# EAGLE design Adafruit_ADXL345 (EAGLE 6.3)
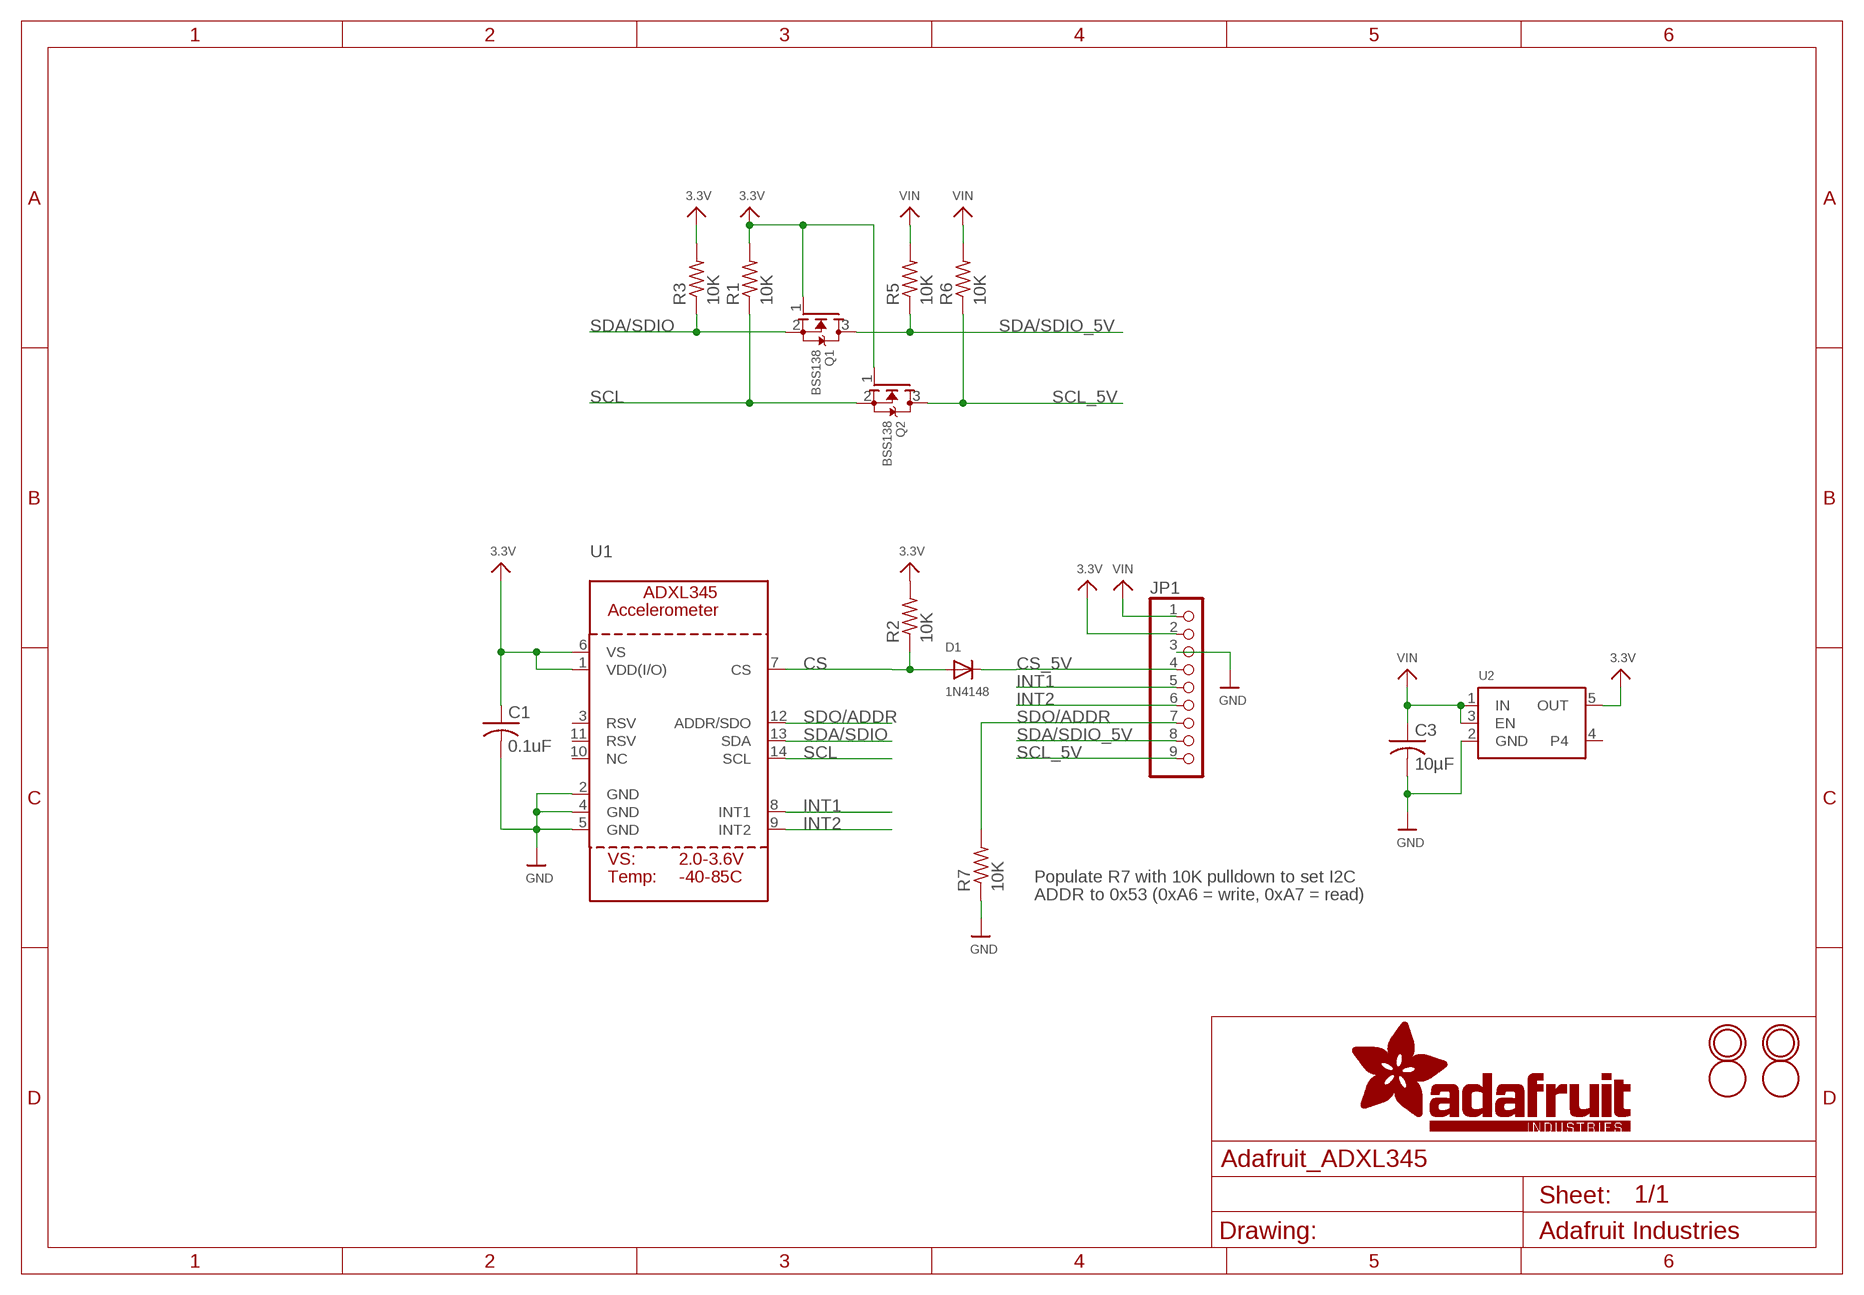
[diagram p0: schematic, sheet 1]

## Parts
C1  0.1uF  C-USC0805  [C0805]
C3  10µF  C-USC0805  [C0805]
D1  1N4148  DIODESOD-323  [SOD-323]
JP1  HEADER-1X970MIL  [1X09_ROUND_70]
Q1  BSS138  MOSFET-NWIDE  [SOT23-WIDE]
Q2  BSS138  MOSFET-NWIDE  [SOT23-WIDE]
R1  10K  R-US_R0805  [R0805]
R2  10K  R-US_R0805  [R0805]
R3  10K  R-US_R0805  [R0805]
R5  10K  R-US_R0805  [R0805]
R6  10K  R-US_R0805  [R0805]
R7  10K  R-US_R0805  [R0805]
U1  ACCEL_ADXL345  [LGA14]
U2  VREG_SOT23-5  [SOT23-5]
U$1  FIDUCIAL  [FIDUCIAL_1MM]
U$3  FIDUCIAL  [FIDUCIAL_1MM]
U$4  MOUNTINGHOLE2.5  [MOUNTINGHOLE_2.5_PLATED]
U$6  MOUNTINGHOLE2.5  [MOUNTINGHOLE_2.5_PLATED]

## Nets
3.3V: C1.1 JP1.2 Q1.1(G) Q2.1(G) R1.2 R2.2 R3.2 U1.1(VDD(I/O)) U1.6(VS) U2.5(OUT)
CS: D1.A R2.1 U1.7(CS)
CS_5V: D1.C JP1.4
GND: C1.2 C3.2 JP1.3 R7.1 U1.2(GND) U1.4(GND) U1.5(GND) U2.2(GND)
INT1: JP1.5 U1.8(INT1)
INT2: JP1.6 U1.9(INT2)
SCL: Q2.2(S) R1.1 U1.14(SCL)
SCL_5V: JP1.9 Q2.3(D) R6.1
SDA/SDIO: Q1.2(S) R3.1 U1.13(SDA)
SDA/SDIO_5V: JP1.8 Q1.3(D) R5.1
SDO/ADDR: JP1.7 R7.2 U1.12(ADDR/SDO)
VIN: C3.1 JP1.1 R5.2 R6.2 U2.1(IN) U2.3(EN)
Unconnected: U1.3(RSV) U1.10(NC) U1.11(RSV) U2.4

## Notes on the sheet
- Populate R7 with 10K pulldown to set I2C
- ADDR to 0x53 (0xA6 = write, 0xA7 = read)

## Library data of the parts
C1 C3 = adafruit:C-US: CAPACITOR, American symbol
D1 = microbuilder:DIODE: Diode SMA Model Volts Amps Type Vf Vr Digikey # Notes SSA34-E3 40V 3A Schottky 480mV @ 3A 200uA @ 40V SSA34-E3/61TGITR-ND CDBA120-G 20V 1A Schottky 500mV @ 1A 500uA @ 20V 641-1014-6-ND REEL MBRA210 10V 2A Schottky 350mV @ 2A 700uA @ 10V MBRA210LT3 SOD-123 Model Volts Amps Type Vf Vr Order # Notes BAT54T1G 30V 200mA Schottky 800mV @ 200mA 2uA @ 25V BAT54T1GOSTR-ND B0530W 30V 500mA Schottky 430mV @ 500mA 130uA @ 30V B0530W-FDICT-ND REEL MBR120 20V 1A Schottky 340mV @ 1A MBR120VLSFT1GOSCT-ND SOD-323 Model Volts Amps Type Vf Vr Order # Notes PMEG2005EJ 20V 500mA Schottky 355mV @ 500mA 568-4110-1-ND ZLLS410 10V 570mA Schottky 380mV @ 570mA ZLLS410CT-ND 1N4148WS 75V 150mA Silicon/Simple 1V 1N4148WSFSCT-ND REEL SOD-523 Model Volts Amps Type Vf Vr Order # Notes BAT54XV2 30V 200mA Schottky 0.8V @ 100mA BAT54XV2CT-ND TB751S 30V 30mA Schottky RB751S-40TE61CT-ND SOT23-R/W (R = Solder Paste/Reflow Ovens, W = Hand-Soldering) Model Volts Amps Type Vf Vr Order # Notes BAT54FILM 40V 300mA Schottky 497-7162-1-ND
JP1 = microbuilder:HEADER-1X9: PIN HEADER
Q1 Q2 = microbuilder:MOSFET-N: N-Channel Mosfet LEGEND VDS: Voltage Drain-Source ID: Drain Current RDS(ON): Drain-Source On-State Resistance VGS(TH): Gate-Source Threshold Voltage CISS: Drain-Source Input Capacitance SOT-23 Name VDS ID RDS(ON) VGS(TH) CISS Order Number 2N7002E 60V 260mA 2.5 Ohm 2.5V @ 250uA 26.7pF @ 25V 2N7002ET1GOSTR-ND BSH103 30V 850mA 400 mOhm 400mV @ 1mA 83pF @ 24V BSH103,235-ND BSS138 60V 320mA 1.6 Ohm 1.5V @ 250uA 50pF @ 10V Mouser: 771-BSS138PW115 DMN2075U-7 20V 4.2A 38 mOhm 1V @ 250 uA 594.3pF @ 10V DMN2075U-7DICT-ND * BSS138 good choice for I2C level-shifting
R1-R3 R5-R7 = adafruit:R-US_: RESISTOR, American symbol
U1 = microbuilder:ACCEL_ADXL345: ADXL345 - Digital 3-Axis Accelerometer (I2C/SPI)
U2 = microbuilder:VREG_SOT23-5: SOT23-5 Fixed Voltage Regulators Part Current Out V Out V In V Dropout θJA (°C/W) TJ (°C) Digikey Part No. ADP121 150mA 3.3V 3.4-5.5V 0.09V @ 150mA -- -- ADP121-AUJZ33R7CT-ND ADP121 150mA 3.0V 3.1-5.5V 0.09V @ 150mA -- -- ADP121-AUJZ30R7CT-ND ADP122 300mA 3.3V 3.4-5.5V 0.085V @ 300mA -- -- ADP122AUJZ-3.3-R7CT-ND ADP1712 300mA 3.3V 3.5-5.5V 0.17V @ 300mA -- -- ADP1712AUJZ-3.3-R7TR-ND AP7311 (Low Cost) 150mA 3.3V 3.5-6V 0.15V @ 150mA -- -- AP7311-33WG-7DICT-ND LD39015M18R 150mA 1.8V 1.9V-5.5V 0.08V @ 100mA -- -- 497-6977-1-ND LP2985A-33DBVR 150mA 3.3V 3.3-16V 0.28V @ 150mA 206 150 296-18479-1-ND MCP1824T-3302E/OT 300mA 3.3V 3.5V-6V 0.2V @ 300mA -- -- MCP1824T-3302E/OTCT-ND MIC5205-2.5YM5 TR 150mA 2.5V 2.7-16V 0.165V @ 150mA -- -- 576-1257-2-ND MIC5205-3.0YM5 TR 150mA 3.0V 3.2V-16V 0.165V @ 150mA -- -- 576-1258-2-ND MIC5205-3.3YM5 TR 150mA 3.3V 3.5V-16V 0.165V @ 150mA -- -- 576-1259-2-ND TPS780330220 150mA 3.3V+2.2V 3.6-5.5V 250mV Max -- -- 296-23332-1-ND TDA3663/N1,135 100mA 3.3V 3.5-45V 0.18V @ 50mA -- -- 568-5343-1-ND Max operating temp can be calculated using θJA, TJ (max junction temperature), and power in watts. Set the "Maximum Ambient Temperature" until it reaches TJ ("Max Junction Temperature"), which is the absolute limit for safe use of the regulator: Heat Sink Temperature Calculator <http://www.daycounter.com/Calculators/Heat-Sink-Temperature-Calculator.phtml> For example, With 12V source into a 3.3V LP2985 and a 30mA load, we are dissipating (12V-3.3V) * 0.03A = 0.261W. With a θJA of 206 °C/W, a TJ of 150°C, and 261mW we can safely use the chip without a heat sink up to 75°C (=147.1°C Junction Temperature).
U$1 U$3 = adafruit:FIDUCIAL: For use by pick and place machines to calibrate the vision/machine, 1mm By microbuilder.eu
U$4 U$6 = microbuilder:MOUNTINGHOLE: Mounting Hole For #2 screws (0.086"/2.18mm width, 0.094"/2.4mm hole) use 2.5mm

## Board
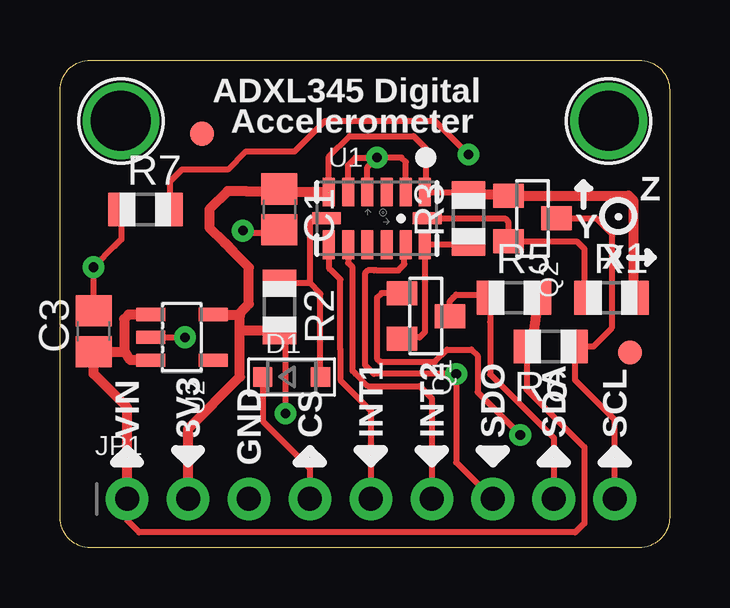
[diagram p1: board, top side]
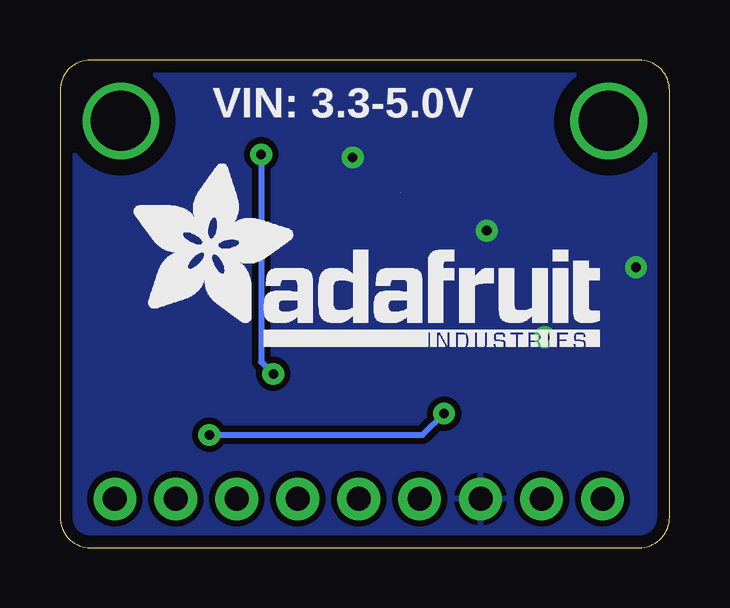
[diagram p2: board, bottom side, seen from below]

Size 25.4 x 20.32 mm. Coordinates in mm from the lower left corner, seen from the top.
Outline: 1.27,0 arc-90 0,1.27 0,19.05 arc-90 1.27,20.32 24.13,20.32 arc-90 25.4,19.05 25.4,1.27 arc-90 24.13,0 1.27,0
Copper layers (1*16): Top 0.035mm / dielectric 1.5mm / Bottom 0.035mm
Design rules "default": minimum track width 8mil, minimum drill 0.4mm, track to track 8mil, track to pad 8mil, pad to pad 8mil, via to via 8mil, smd to smd 8mil, copper to edge 20mil, drill to drill 8mil, minimum pad ring 8mil, minimum via ring 10mil, stop-mask expansion 3mil, vias tented up to drill 20mil, thermal gap 8mil

### Footprints (pad centres in the part's own frame; a part is rotated, then mirrored left to right if it is on the bottom)
C0805 = smd 1.3 x 1.5: 1 -0.85,0; 2 0.85,0
SOD-323 = smd 0.8 x 0.8: A 1.2,0; C -1.2,0
1X09_ROUND_70 = drill 1 pad 1.778: 1 -10.16,0; 2 -7.62,0; 3 -5.08,0; 4 -2.54,0; 5 0,0; 6 2.54,0; 7 5.08,0; 8 7.62,0; 9 10.16,0
SOT23-WIDE = smd 1 x 1.27: 1 -0.95,-1; 2 0.95,-1; 3 0,1
R0805 = smd 1.1 x 1.4: 1 -1,0; 2 1,0
LGA14 = smd 0.5 x 1.2: 1 2,1.1; 2 1.2,1.1; 3 0.4,1.1; 4 -0.4,1.1; 5 -1.2,1.1; 6 -2,1.1; 8 -2,-1.1; 9 -1.2,-1.1; 10 -0.4,-1.1; 11 0.4,-1.1; 12 1.2,-1.1; 13 2,-1.1 | smd 1.2 x 0.5: 7 -2.1,0; 14 2.1,0
SOT23-5 = smd 0.55 x 1.2: 1 -0.95,-1.3; 2 0,-1.3; 3 0.95,-1.3; 4 0.95,1.3; 5 -0.95,1.3
FIDUCIAL_1MM = smd 1 x 1: 1 0,0
MOUNTINGHOLE_2.5_PLATED = drill 2.5 pad 3.2: P$1 0,0

### Placement (x,y rotation side)
C1  9.14,14.1 270 top
C3  1.4,9.02 90 top
D1  9.65,7.11 0 top
JP1  12.95,2.03 0 top
Q1  15.24,9.65 270 top
Q2  19.68,13.72 270 top
R1  22.99,10.41 0 top
R2  9.14,10.03 270 top
R3  17.02,13.72 90 top
R5  18.92,10.41 0 top
R6  20.45,8.38 180 top
R7  3.56,14.1 0 top
U1  13.21,13.72 0 top
U2  5.08,8.76 270 top
U$1  5.92,17.25 0 top
U$3  23.75,8.13 0 top
U$4  22.86,17.78 0 top
U$6  2.54,17.78 0 top
U$7  [ADAFRUIT_TEXT_20MM]  22.48,8.38 0 bottom

### Tracks (layer width: path | path; a pad name or v marks a point on that pad's centre or on a via)
3.3V  (via drill 0.4)  (1 unrouted)
  Top 0.254: Q1.1 13.4,10.6 13.21,10.41 13.21,7.87 13.34,7.75 15.62,7.75 16.13,8.26 17.14,8.26 17.4,8 17.4,6.48 v19.18,4.7 | v9.4,5.59 9.4,8.78 R2.2 | R3.2 17.02,14.82 U1.1 15.24,14.85 15.24,16.64 14.73,17.14 12.06,17.14 11.21,16.29 U1.6
  Top 0.406: U2.5 7.43,9.71 | 7.43,9.71 7.75,10.03 7.87,10.16 7.87,11.68 7.24,12.32 6.86,12.7 6.22,13.34 6.22,14.1 6.99,14.86 7.75,14.86 9.06,14.86 C1.1 9.27,14.82 U1.6 | 16.92,14.82 R3.2 18.64,14.72 Q2.1 23.69,14.67 23.88,14.48 23.88,10.43 R1.2 | JP1.2 5.33,4.95 7.49,7.11 7.49,9.14 | 7.49,9.14 7.49,9.65 7.43,9.71 | R2.2 7.6,9.03 7.49,9.14
  Bottom 0.254: v19.18,4.7 10.29,4.7 v9.4,5.59
CS
  Top 0.254: R2.1 10.4,11.03 | 10.4,11.03 10.41,11.05 10.41,13.59 10.54,13.72 U1.7 | D1.A 10.85,10.58 10.4,11.03
CS_5V
  Top 0.254: JP1.4 10.41,3.3 8.45,5.26 D1.C
GND  (via drill 0.4)
  Top 0.254: U2.2 v5.21,8.76 | v7.62,13.21 7.71,13.12 9.02,13.12 C1.2 | C3.2 v1.4,11.68 2.29,12.58 2.56,12.84 R7.1 | U1.5 12.01,15.95 12.32,16.26 v13.21,16.26 | U1.4 12.81,15.86 v13.21,16.26 | U1.2 14.41,16.07 14.22,16.26 v13.21,16.26
  Bottom 0.254: v7.62,13.21 7.62,13.46 | v1.4,11.68 1.4,11.43
  pour Bottom (isolate 0.254): 0,20.32 25.4,20.32 25.4,0 0,0
INT1
  Top 0.254: JP1.5 12.95,5.71 11.68,6.99 11.68,8.26 11.68,11.18 11.3,11.56 11.21,11.65 11.21,11.78 U1.8
INT2
  Top 0.254: JP1.6 15.49,6.22 14.99,6.73 12.83,6.73 12.32,7.24 12.19,7.37 12.19,11.68 12.01,11.87 U1.9
SCL
  Top 0.254: R1.1 21.84,10.43 21.84,12.45 21.52,12.77 Q2.2 18.67,12.78 18.67,13.59 18.54,13.72 U1.14
SCL_5V
  Top 0.254: JP1.9 23.11,5.33 21.46,6.99 21.46,8.37 R6.1 22.23,8.38 22.99,9.14 22.99,13.08 22.35,13.72 Q2.3
SDA/SDIO
  Top 0.254: R3.1 16.92,12.62 U1.13 15.21,8.98 14.99,8.76 14.3,8.76 Q1.2
SDA/SDIO_5V
  Top 0.254: JP1.8 20.57,4.57 17.92,7.22 17.92,9.4 R5.1 17.8,10.54 16.51,10.54 16.38,10.41 16.24,10.27 Q1.3
SDO/ADDR  (via drill 0.4)
  Top 0.254: 14.35,12.06 14.35,11.81 14.1,11.56 13.21,11.56 13.08,11.56 12.83,11.56 12.7,11.43 12.7,7.62 12.83,7.49 13.08,7.24 16.38,7.24 v16.51,7.24 16.51,3.56 JP1.7 | 14.35,12.06 14.35,12.56 | v17.02,16.38 15.62,17.78 11.05,17.78 9.78,16.51 7.75,16.51 6.99,15.75 5.08,15.75 4.57,15.24 4.57,14.11 R7.2 | U1.12 14.35,12.62 14.35,12.06
  Bottom 0.254: v17.02,16.38 17.02,7.75 v16.51,7.24
VIN
  Top 0.254: R6.2 19.45,6.59 21.72,4.32 21.84,4.19 21.84,1.02 21.46,0.64 3.3,0.64 2.79,1.14 JP1.1
  Top 0.406: JP1.1 2.79,5.84 1.4,7.24 C3.1 2.71,8.17 | R5.2 19.67,8.6 R6.2 | U2.1 2.85,9.71 2.67,9.53 2.67,8.26 2.71,8.17 | U2.3 2.93,7.81 2.71,8.17

### Text on the board
tPlace: ADXL345 Digital | Accelerometer | Z | Y | X | VIN | 3V3 | CS | INT1 | INT2 | SDO | SDA | SCL | GND
bPlace: VIN: 3.3-5.0V